# EAGLE design 19099 (EAGLE 7.6.0)
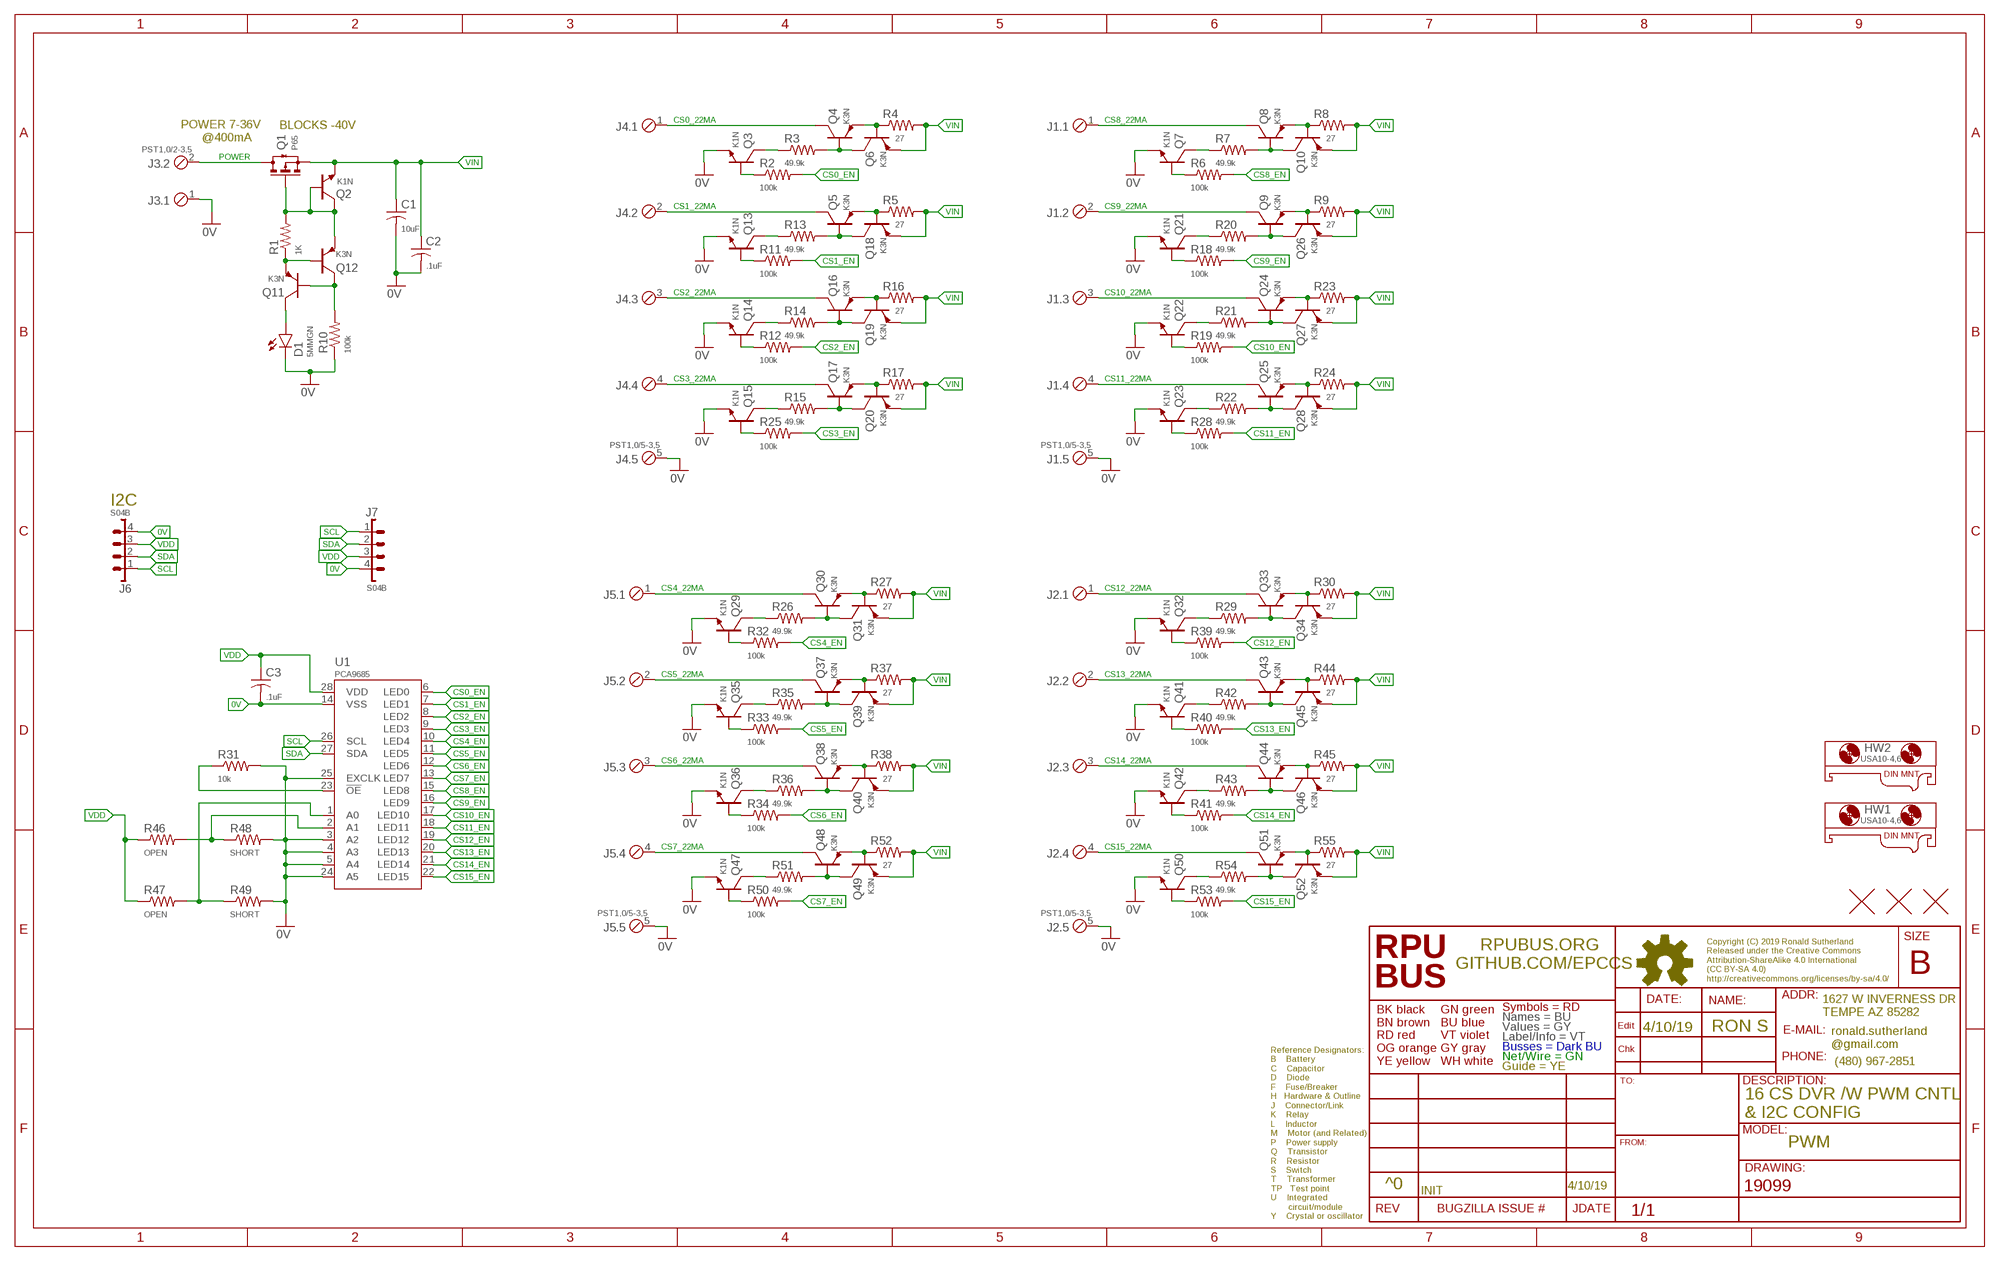
[diagram p0: schematic, sheet 1]

## Parts
C1  10uF  CC1206  [C1206(3216)]
C2  .1uF  CC0805A  [C0805(2012)]
C3  .1uF  CC0603A  [C0603(1608)]
D1  5MMGN  LED5MM  [LED5MM]
HW1  USA10-4,6  MOUNT-HOLE5.0  [USA10]
HW2  USA10-4,6  MOUNT-HOLE5.0  [USA10]
J1  PST1,0/5-3,5  MCV5  [MCV5]
J2  PST1,0/5-3,5  MCV5  [MCV5]
J3  PST1,0/2-3,5  MCV2  [MCV2]
J4  PST1,0/5-3,5  MCV5  [MCV5]
J5  PST1,0/5-3,5  MCV5  [MCV5]
J6  S04B  B04B  [B04B]
J7  S04B  B04B  [B04B]
Q1  P65  N-CHSOT23  [SOT23]
Q2  K1N  NPNSOT23  [SOT23]
Q3  K1N  NPNSOT23  [SOT23]
Q4  K3N  PNPSOT23  [SOT23]
Q5  K3N  PNPSOT23  [SOT23]
Q6  K3N  PNPSOT23  [SOT23]
Q7  K1N  NPNSOT23  [SOT23]
Q8  K3N  PNPSOT23  [SOT23]
Q9  K3N  PNPSOT23  [SOT23]
Q10  K3N  PNPSOT23  [SOT23]
Q11  K3N  PNPSOT23  [SOT23]
Q12  K3N  PNPSOT23  [SOT23]
Q13  K1N  NPNSOT23  [SOT23]
Q14  K1N  NPNSOT23  [SOT23]
Q15  K1N  NPNSOT23  [SOT23]
Q16  K3N  PNPSOT23  [SOT23]
Q17  K3N  PNPSOT23  [SOT23]
Q18  K3N  PNPSOT23  [SOT23]
Q19  K3N  PNPSOT23  [SOT23]
Q20  K3N  PNPSOT23  [SOT23]
Q21  K1N  NPNSOT23  [SOT23]
Q22  K1N  NPNSOT23  [SOT23]
Q23  K1N  NPNSOT23  [SOT23]
Q24  K3N  PNPSOT23  [SOT23]
Q25  K3N  PNPSOT23  [SOT23]
Q26  K3N  PNPSOT23  [SOT23]
Q27  K3N  PNPSOT23  [SOT23]
Q28  K3N  PNPSOT23  [SOT23]
Q29  K1N  NPNSOT23  [SOT23]
Q30  K3N  PNPSOT23  [SOT23]
Q31  K3N  PNPSOT23  [SOT23]
Q32  K1N  NPNSOT23  [SOT23]
Q33  K3N  PNPSOT23  [SOT23]
Q34  K3N  PNPSOT23  [SOT23]
Q35  K1N  NPNSOT23  [SOT23]
Q36  K1N  NPNSOT23  [SOT23]
Q37  K3N  PNPSOT23  [SOT23]
Q38  K3N  PNPSOT23  [SOT23]
Q39  K3N  PNPSOT23  [SOT23]
Q40  K3N  PNPSOT23  [SOT23]
Q41  K1N  NPNSOT23  [SOT23]
Q42  K1N  NPNSOT23  [SOT23]
Q43  K3N  PNPSOT23  [SOT23]
Q44  K3N  PNPSOT23  [SOT23]
Q45  K3N  PNPSOT23  [SOT23]
Q46  K3N  PNPSOT23  [SOT23]
Q47  K1N  NPNSOT23  [SOT23]
Q48  K3N  PNPSOT23  [SOT23]
Q49  K3N  PNPSOT23  [SOT23]
Q50  K1N  NPNSOT23  [SOT23]
Q51  K3N  PNPSOT23  [SOT23]
Q52  K3N  PNPSOT23  [SOT23]
R1  1K  R0805  [C0805(2012)]
R2  100k  R0805  [C0805(2012)]
R3  49.9k  R0805  [C0805(2012)]
R4  27  R0805  [C0805(2012)]
R5  27  R0805  [C0805(2012)]
R6  100k  R0805  [C0805(2012)]
R7  49.9k  R0805  [C0805(2012)]
R8  27  R0805  [C0805(2012)]
R9  27  R0805  [C0805(2012)]
R10  100k  R0805  [C0805(2012)]
R11  100k  R0805  [C0805(2012)]
R12  100k  R0805  [C0805(2012)]
R13  49.9k  R0805  [C0805(2012)]
R14  49.9k  R0805  [C0805(2012)]
R15  49.9k  R0805  [C0805(2012)]
R16  27  R0805  [C0805(2012)]
R17  27  R0805  [C0805(2012)]
R18  100k  R0805  [C0805(2012)]
R19  100k  R0805  [C0805(2012)]
R20  49.9k  R0805  [C0805(2012)]
R21  49.9k  R0805  [C0805(2012)]
R22  49.9k  R0805  [C0805(2012)]
R23  27  R0805  [C0805(2012)]
R24  27  R0805  [C0805(2012)]
R25  100k  R0805  [C0805(2012)]
R26  49.9k  R0805  [C0805(2012)]
R27  27  R0805  [C0805(2012)]
R28  100k  R0805  [C0805(2012)]
R29  49.9k  R0805  [C0805(2012)]
R30  27  R0805  [C0805(2012)]
R31  10k  R0805  [C0805(2012)]
R32  100k  R0805  [C0805(2012)]
R33  100k  R0805  [C0805(2012)]
R34  100k  R0805  [C0805(2012)]
R35  49.9k  R0805  [C0805(2012)]
R36  49.9k  R0805  [C0805(2012)]
R37  27  R0805  [C0805(2012)]
R38  27  R0805  [C0805(2012)]
R39  100k  R0805  [C0805(2012)]
R40  100k  R0805  [C0805(2012)]
R41  100k  R0805  [C0805(2012)]
R42  49.9k  R0805  [C0805(2012)]
R43  49.9k  R0805  [C0805(2012)]
R44  27  R0805  [C0805(2012)]
R45  27  R0805  [C0805(2012)]
R46  OPEN  R0805  [C0805(2012)]
R47  OPEN  R0805  [C0805(2012)]
R48  SHORT  R0805  [C0805(2012)]
R49  SHORT  R0805  [C0805(2012)]
R50  100k  R0805  [C0805(2012)]
R51  49.9k  R0805  [C0805(2012)]
R52  27  R0805  [C0805(2012)]
R53  100k  R0805  [C0805(2012)]
R54  49.9k  R0805  [C0805(2012)]
R55  27  R0805  [C0805(2012)]
U1  PCA9685  [28TSSOP]
U$2  FIDUCIAL1.27  [FIDUCIAL-1.27]
U$3  FIDUCIAL1.27  [FIDUCIAL-1.27]
U$4  FIDUCIAL1.27  [FIDUCIAL-1.27]

## Nets
0V: C1.2 C2.2 C3.2 D1.K J1.5 J2.5 J3.1 J4.5 J5.5 J6.4 J7.4 Q3.E Q7.E Q13.E Q14.E Q15.E Q21.E Q22.E Q23.E Q29.E Q32.E Q35.E Q36.E Q41.E Q42.E Q47.E Q50.E R10.1 R31.2 R48.2 R49.2 U1.3(A2) U1.4(A3) U1.5(A4) U1.14(VSS) U1.24(A5) U1.25(EXCLK)
A0: R47.2 R49.1 U1.1(A0)
A1: R46.2 R48.1 U1.2(A1)
CS0_22MA: J4.1 Q4.C
CS0_EN: R2.2 U1.6(LED0)
CS1_22MA: J4.2 Q5.C
CS1_EN: R11.2 U1.7(LED1)
CS2_22MA: J4.3 Q16.C
CS2_EN: R12.2 U1.8(LED2)
CS3_22MA: J4.4 Q17.C
CS3_EN: R25.2 U1.9(LED3)
CS4_22MA: J5.1 Q30.C
CS4_EN: R32.2 U1.10(LED4)
CS5_22MA: J5.2 Q37.C
CS5_EN: R33.2 U1.11(LED5)
CS6_22MA: J5.3 Q38.C
CS6_EN: R34.2 U1.12(LED6)
CS7_22MA: J5.4 Q48.C
CS7_EN: R50.2 U1.13(LED7)
CS8_22MA: J1.1 Q8.C
CS8_EN: R6.2 U1.15(LED8)
CS9_22MA: J1.2 Q9.C
CS9_EN: R18.2 U1.16(LED9)
CS10_22MA: J1.3 Q24.C
CS10_EN: R19.2 U1.17(LED10)
CS11_22MA: J1.4 Q25.C
CS11_EN: R28.2 U1.18(LED11)
CS12_22MA: J2.1 Q33.C
CS12_EN: R39.2 U1.19(LED12)
CS13_22MA: J2.2 Q43.C
CS13_EN: R40.2 U1.20(LED13)
CS14_22MA: J2.3 Q44.C
CS14_EN: R41.2 U1.21(LED14)
CS15_22MA: J2.4 Q51.C
CS15_EN: R53.2 U1.22(LED15)
N$1: Q4.E Q6.B R4.1
N$2: Q3.B R2.1
N$3: Q5.E Q18.B R5.1
N$4: Q5.B Q18.C R13.2
N$5: Q11.B Q12.C R10.2
N$6: Q1.1(G)(G) Q2.B Q2.C Q12.E R1.2
N$7: D1.A Q11.C
N$8: Q13.C R13.1
N$9: Q4.B Q6.C R3.2
N$10: Q11.E Q12.B R1.1
N$11: Q13.B R11.1
N$12: Q16.E Q19.B R16.1
N$13: Q16.B Q19.C R14.2
N$14: Q14.C R14.1
N$15: Q14.B R12.1
N$16: Q17.E Q20.B R17.1
N$17: Q17.B Q20.C R15.2
N$18: Q15.C R15.1
N$19: Q15.B R25.1
N$22: R31.1 U1.23(!OE)
N$23: Q30.E Q31.B R27.1
N$24: Q30.B Q31.C R26.2
N$25: Q29.C R26.1
N$26: Q29.B R32.1
N$27: Q37.E Q39.B R37.1
N$28: Q37.B Q39.C R35.2
N$29: Q35.C R35.1
N$30: Q35.B R33.1
N$31: Q38.E Q40.B R38.1
N$32: Q38.B Q40.C R36.2
N$33: Q36.C R36.1
N$34: Q36.B R34.1
N$35: Q48.E Q49.B R52.1
N$36: Q48.B Q49.C R51.2
N$37: Q47.C R51.1
N$38: Q47.B R50.1
N$39: Q8.E Q10.B R8.1
N$40: Q8.B Q10.C R7.2
N$41: Q7.C R7.1
N$42: Q7.B R6.1
N$43: Q9.E Q26.B R9.1
N$44: Q9.B Q26.C R20.2
N$45: Q21.C R20.1
N$46: Q21.B R18.1
N$47: Q24.E Q27.B R23.1
N$48: Q24.B Q27.C R21.2
N$49: Q22.C R21.1
N$50: Q22.B R19.1
N$51: Q25.E Q28.B R24.1
N$52: Q25.B Q28.C R22.2
N$53: Q23.C R22.1
N$54: Q23.B R28.1
N$55: Q33.E Q34.B R30.1
N$56: Q33.B Q34.C R29.2
N$57: Q32.C R29.1
N$58: Q32.B R39.1
N$59: Q43.E Q45.B R44.1
N$60: Q3.C R3.1
N$61: Q43.B Q45.C R42.2
N$62: Q41.C R42.1
N$63: Q41.B R40.1
N$64: Q44.E Q46.B R45.1
N$65: Q44.B Q46.C R43.2
N$66: Q42.C R43.1
N$67: Q42.B R41.1
N$68: Q51.E Q52.B R55.1
N$69: Q51.B Q52.C R54.2
N$70: Q50.C R54.1
N$71: Q50.B R53.1
POWER: J3.2 Q1.3(D)(D)
SCL: J6.1 J7.1 U1.26(SCL)
SDA: J6.2 J7.2 U1.27(SDA)
VDD: C3.1 J6.3 J7.3 R46.1 R47.1 U1.28(VDD)
VIN: C1.1 C2.1 Q1.2(S)(S) Q2.E Q6.E Q10.E Q18.E Q19.E Q20.E Q26.E Q27.E Q28.E Q31.E Q34.E Q39.E Q40.E Q45.E Q46.E Q49.E Q52.E R4.2 R5.2 R8.2 R9.2 R16.2 R17.2 R23.2 R24.2 R27.2 R30.2 R37.2 R38.2 R44.2 R45.2 R52.2 R55.2

## Notes on the sheet
- BLOCKS -40V
- POWER 7-36V 
        @400mA
- I2C
- 4/10/19 | RON S
- 16 CS DVR /W PWM CNTL
  & I2C CONFIG
- PWM
- ^0 | 4/10/19
- INIT

## Library data of the parts
C1-C3 = C-C:C: CAPACITOR Symbol
D1 = D-LED:LED: LED 120120WH [CREE,XHGAWT-00-0000-00000HXE1] LED WHITE 6500K 150LUM-W120120
HW1 HW2 = HW-DINMnt:MOUNT-HOLE: USA10-4.6 [PhxCont,1202713] DINRAIL ADAPTER UNIVERSAL 10MM 4.6MM
J1 J2 J4 J5 = J-HDR3.5mm:MCV5: MCV 1,5/5-G-3,5-RN [PHOENIX CONTACT,1843635] CONN HEADER SHROUDED 5POS 3.5MM MCVR 1,5/5-ST-3,5 [PHOENIX CONTACT,1863181] CONN PLUG 5POS SCREW 3.5MM PST 1,0/5-3,5 [PHOENIX CONTACT,1945122] CONN HEADER STRIP PIN 5POS 3.5MM PT 1,5/5-PVH-3,5 [PHOENIX CONTACT,1984044] CONN PLUG STRIP 4POS 3.5MM Drill Size 3/64": .0469" (1.2mm)
J3 = J-HDR3.5mm:MCV2: MCV 1,5/ 2-G-3,5-RN [PHOENIX CONTACT,1731471] CONN HEADER SHROUDED 2POS 3.5MM MCVR 1,5/ 2-ST-3,5 [PHOENIX CONTACT,1863152] CONN PLUG 2POS SCREW 3.5MM PST 1,0/2-3,5 [PHOENIX CONTACT,1945096] CONN HEADER STRIP PIN 2POS 3.5MM PT1,5/2-PVH-3,5 [PHOENIX CONTACT,1984015] CONN PLUG STRIP 2POS 3.5MM
J6 J7 = J-HDR2mm:B04B: B04B [JST@B04B-PASK] CONN HEADER VERT THRU 4POS S04B [JST@S04B-PASK] CONN HEADER SIDE THRU 4POS
Q1 = Q-PCH:N-CH?*: ENHANCEMENT MODE MOSFET SOT23 is BSS138 pinout
Q2 Q3 Q7 Q13-Q15 Q21-Q23 Q29 Q32 Q35 Q36 Q41 Q42 Q47 Q50 = Q-NPN:NPN: BJT NPN General Purpose Amplifier
Q4-Q6 Q8-Q12 Q16-Q20 Q24-Q28 Q30 Q31 Q33 Q34 Q37-Q40 Q43-Q46 Q48 Q49 Q51 Q52 = Q-PNP:PNP: BJT NPN General Purpose Amplifier
R1-R55 = R-C:R: Resiistor American-style symbol
U1 = U-Linear:PCA9685: PCA9685 16-channel, I2C-bus commanded 12-bit PWM controller
U$2-U$4 = H-Fiducial:FIDUCIAL: Fiducial Alignment Points Various fiducial points for machine vision alignment.

## Net classes
0 default: width 0.178 mm, drill 0.33 mm

## Board
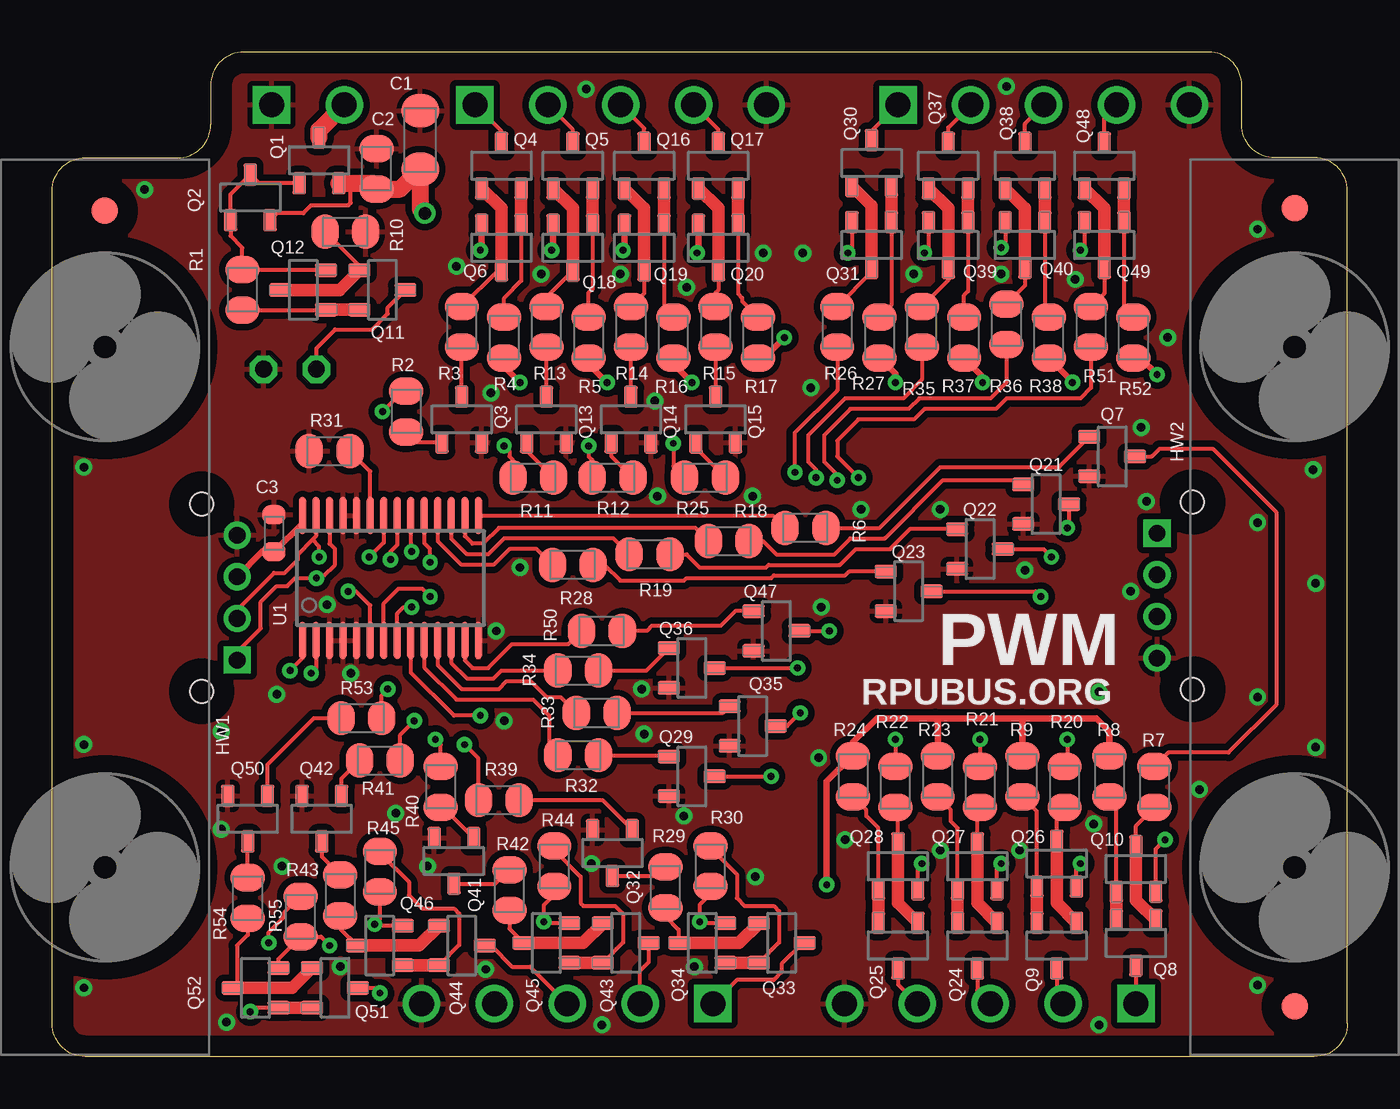
[diagram p1: board, top side]
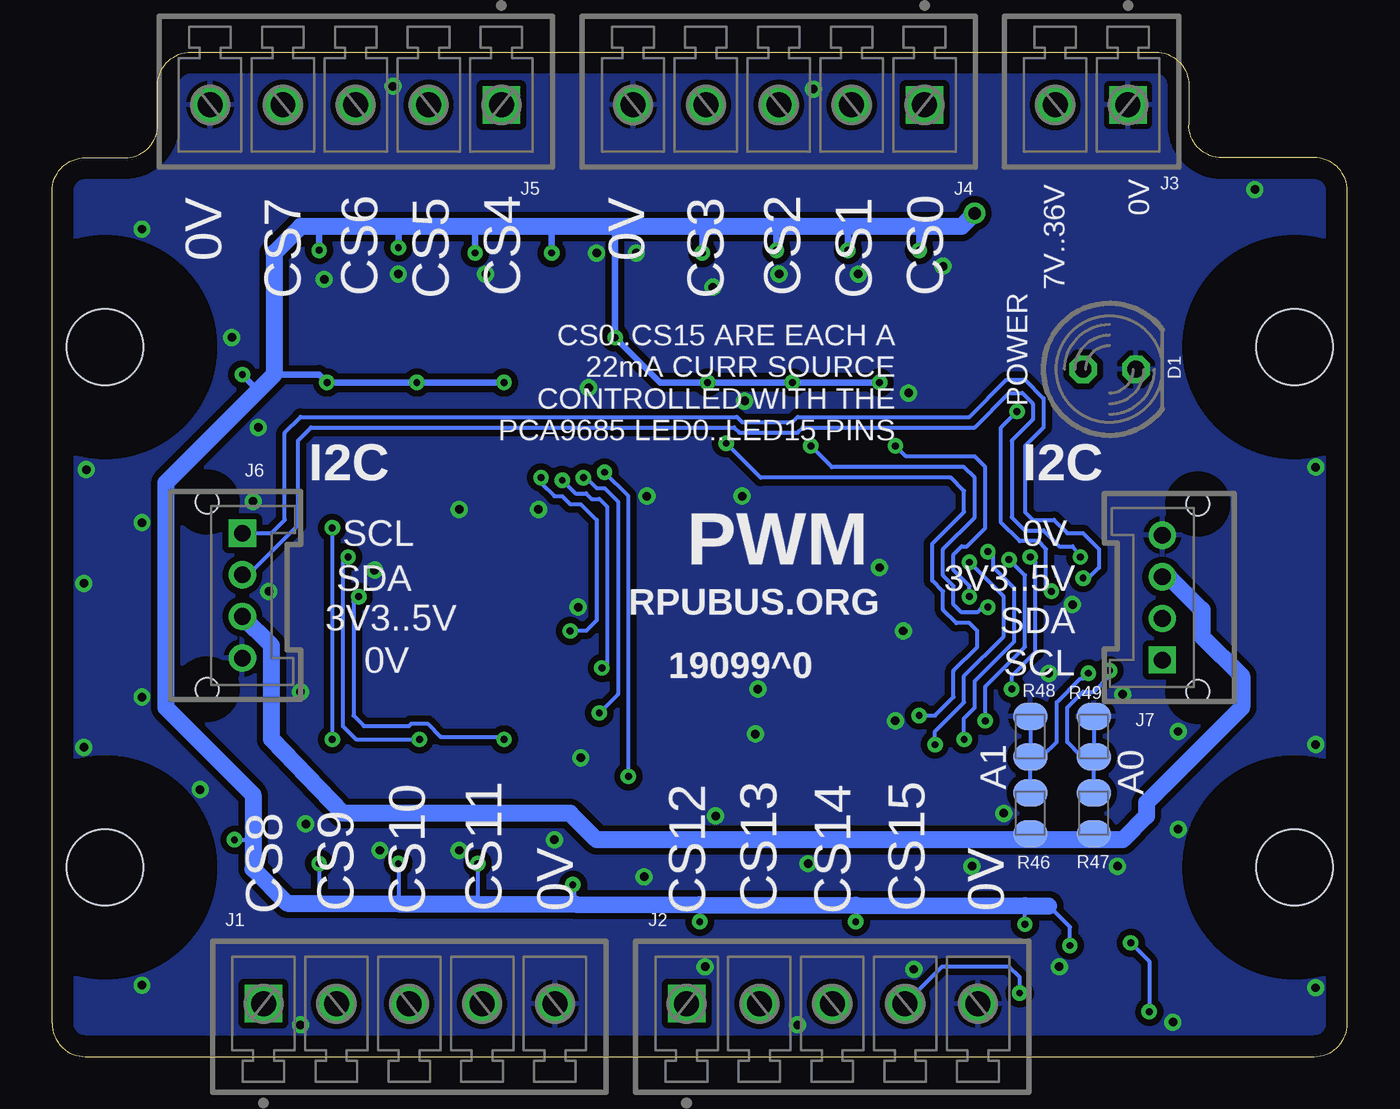
[diagram p2: board, bottom side, seen from below]

Size 62.23 x 48.26 mm. Coordinates in mm from the lower left corner, seen from the top.
Outline: 62.23,1.59 62.23,41.59 arc90 60.64,43.18 58.74,43.18 arc-90 57.15,44.77 57.15,46.67 arc90 55.56,48.26 9.21,48.26 arc90 7.62,46.67 7.62,44.77 arc-90 6.03,43.18 1.59,43.18 arc90 0,41.59 0,1.59 arc90 1.59,0 60.64,0 arc90 62.23,1.59
Copper layers (1*16): Top 0.034290625mm / dielectric 60mil / Bottom 0.034290625mm
Design rules "default *": minimum track width 7mil, minimum drill 13mil, track to track 12mil, track to pad 10mil, pad to pad 8mil, via to via 12mil, smd to smd 8mil, copper to edge 40mil, drill to drill 16mil, minimum pad ring 10mil, minimum via ring 8mil, stop-mask expansion 4mil, vias tented up to drill 17mil, thermal gap 10mil

### Footprints (pad centres in the part's own frame; a part is rotated, then mirrored left to right if it is on the bottom)
C1206(3216) = smd 1.6 x 1.8: 1 -1.4,0; 2 1.4,0
C0805(2012) = smd 1.321 x 1.651: 1 -0.977,0; 2 0.977,0
C0603(1608) = smd 0.898 x 1.1: 1 -0.889,0; 2 0.889,0
LED5MM = drill 0.813 octagon: A -1.27,0; K 1.27,0
USA10 = hole 3.658: -12.5,0; 12.5,0
MCV5 = drill 1.2 square: 1 0,0 | drill 1.2: 2 3.5,0; 3 7,0; 4 10.5,0; 5 14,0
MCV2 = drill 1.2 square: 1 0,0 | drill 1.2: 2 3.5,0
B04B = drill 0.8 square: 1 0,0 | drill 0.8: 2 2,0; 3 4,0; 4 6,0 | hole 1.1: 7.5,-1.7; -1.5,-1.7
SOT23 = smd 0.65 x 1.06: 1(G) -0.95,-1.1; 2(S) 0.95,-1.1; 3(D) 0,1.1
SOT23' = smd 0.65 x 1.06: B -0.95,-1.1; C 0,1.1; E 0.95,-1.1
28TSSOP = smd 0.33 x 1.8: 1 -4.225,-3; 2 -3.575,-3; 3 -2.925,-3; 4 -2.275,-3; 5 -1.625,-3; 6 -0.975,-3; 7 -0.325,-3; 8 0.325,-3; 9 0.975,-3; 10 1.625,-3; 11 2.275,-3; 12 2.925,-3; 13 3.575,-3; 14 4.225,-3; 15 4.225,3; 16 3.575,3; 17 2.925,3; 18 2.275,3; 19 1.625,3; 20 0.975,3; 21 0.325,3; 22 -0.325,3; 23 -0.975,3; 24 -1.625,3; 25 -2.275,3; 26 -2.925,3; 27 -3.575,3; 28 -4.225,3
FIDUCIAL-1.27 = smd 1.27 x 1.27: 1 0,0

### Placement (x,y rotation side)
C1  17.69,44.03 90 top
C2  15.59,42.65 90 top
C3  10.67,25.15 90 top
D1  11.43,33.02 0 bottom
HW1  2.54,21.59 90 top
HW2  59.69,21.59 90 top
J1  52.07,2.54 0 bottom
J2  31.75,2.54 0 bottom
J3  10.54,45.72 180 bottom
J4  20.32,45.72 180 bottom
J5  40.64,45.72 180 bottom
J6  53.09,25.15 270 bottom
J7  8.89,19.05 90 bottom
Q1  12.83,43.05 0 top
Q2  K1N  [SOT23']  9.53,41.27 0 top
Q3  K1N  [SOT23']  19.68,30.61 0 top
Q4  K3N  [SOT23']  21.59,42.8 0 top
Q5  K3N  [SOT23']  25.02,42.8 0 top
Q6  K3N  [SOT23']  21.59,38.86 180 top
Q7  K1N  [SOT23']  50.93,28.83 270 top
Q8  K3N  [SOT23']  52.07,5.46 180 top
Q9  K3N  [SOT23']  48.26,5.33 180 top
Q10  K3N  [SOT23']  52.07,9.02 0 top
Q11  K3N  [SOT23']  15.88,36.83 270 top
Q12  K3N  [SOT23']  12.07,36.83 90 top
Q13  K1N  [SOT23']  23.75,30.61 0 top
Q14  K1N  [SOT23']  27.81,30.61 0 top
Q15  K1N  [SOT23']  31.88,30.61 0 top
Q16  K3N  [SOT23']  28.45,42.8 0 top
Q17  K3N  [SOT23']  32,42.8 0 top
Q18  K3N  [SOT23']  25.02,38.86 180 top
Q19  K3N  [SOT23']  28.45,38.86 180 top
Q20  K3N  [SOT23']  32,38.86 180 top
Q21  K1N  [SOT23']  47.75,26.54 270 top
Q22  K1N  [SOT23']  44.58,24.38 270 top
Q23  K1N  [SOT23']  41.15,22.35 270 top
Q24  K3N  [SOT23']  44.45,5.33 180 top
Q25  K3N  [SOT23']  40.64,5.33 180 top
Q26  K3N  [SOT23']  48.26,9.27 0 top
Q27  K3N  [SOT23']  44.45,9.14 0 top
Q28  K3N  [SOT23']  40.64,9.14 0 top
Q29  K1N  [SOT23']  30.73,13.46 270 top
Q30  K3N  [SOT23']  39.37,42.93 0 top
Q31  K3N  [SOT23']  39.37,38.99 180 top
Q32  K1N  [SOT23']  26.92,9.78 180 top
Q33  K3N  [SOT23']  35.05,5.46 270 top
Q34  K3N  [SOT23']  31.24,5.46 90 top
Q35  K1N  [SOT23']  33.65,15.88 270 top
Q36  K1N  [SOT23']  30.73,18.67 270 top
Q37  K3N  [SOT23']  43.05,42.8 0 top
Q38  K3N  [SOT23']  46.74,42.8 0 top
Q39  K3N  [SOT23']  43.05,38.99 180 top
Q40  K3N  [SOT23']  46.74,38.99 180 top
Q41  K1N  [SOT23']  19.3,9.4 180 top
Q42  K1N  [SOT23']  12.95,11.43 180 top
Q43  K3N  [SOT23']  27.56,5.46 270 top
Q44  K3N  [SOT23']  19.68,5.33 270 top
Q45  K3N  [SOT23']  23.75,5.46 90 top
Q46  K3N  [SOT23']  15.75,5.33 90 top
Q47  K1N  [SOT23']  34.8,20.45 270 top
Q48  K3N  [SOT23']  50.55,42.8 0 top
Q49  K3N  [SOT23']  50.55,38.99 180 top
Q50  K1N  [SOT23']  9.4,11.43 180 top
Q51  K3N  [SOT23']  13.59,3.3 270 top
Q52  K3N  [SOT23']  9.78,3.3 90 top
R1  9.14,36.83 90 top
R2  17.02,30.99 90 top
R3  19.68,35.05 90 top
R4  21.72,34.54 270 top
R5  25.78,34.54 270 top
R6  36.2,25.4 180 top
R7  52.96,12.95 270 top
R8  50.8,13.46 90 top
R9  46.61,13.46 90 top
R10  14.1,39.62 180 top
R11  23.11,27.81 180 top
R12  26.92,27.81 180 top
R13  23.75,35.05 90 top
R14  27.81,35.05 90 top
R15  31.88,35.05 90 top
R16  29.84,34.54 270 top
R17  33.91,34.54 270 top
R18  32.51,24.77 180 top
R19  28.7,24.13 180 top
R20  48.64,12.95 270 top
R21  44.58,12.95 270 top
R22  40.51,12.95 270 top
R23  42.54,13.46 90 top
R24  38.48,13.46 90 top
R25  31.37,27.81 180 top
R26  37.72,35.05 90 top
R27  39.75,34.54 270 top
R28  25.02,23.62 180 top
R29  29.46,8.13 270 top
R30  31.62,9.14 270 top
R31  13.34,29.08 180 top
R32  25.27,14.48 180 top
R33  26.16,16.51 180 top
R34  25.27,18.54 180 top
R35  41.78,35.05 90 top
R36  45.85,35.18 90 top
R37  43.81,34.54 270 top
R38  47.88,34.54 270 top
R39  21.46,12.32 180 top
R40  18.67,12.95 90 top
R41  15.75,14.22 0 top
R42  21.97,8 270 top
R43  13.84,7.75 270 top
R44  24.13,9.14 270 top
R45  15.75,8.89 270 top
R46  15.24,11.68 90 bottom
R47  12.19,11.68 90 bottom
R48  15.24,15.37 90 bottom
R49  12.19,15.37 90 bottom
R50  26.42,20.45 180 top
R51  49.91,35.05 90 top
R52  51.94,34.54 270 top
R53  14.86,16.26 0 top
R54  9.4,7.62 270 top
R55  11.94,6.73 270 top
U1  16.26,22.99 0 top
U$2  59.69,40.77 0 top
U$3  2.54,40.64 0 top
U$4  59.69,2.41 0 top

### Tracks (layer width: path | path; a pad name or v marks a point on that pad's centre or on a via)
0V  (via drill 0.41)
  other vias: 4.45,41.66 51.82,22.35 52.58,26.67 46.74,23.37 50.29,17.53 49.15,37.34 45.59,37.59 41.4,37.59 36.07,38.61 36.96,21.59 33.65,26.92 21.08,31.88 19.43,37.97 30.48,36.96 27.3,37.59 23.5,37.59 60.58,28.19 57.91,25.65 57.91,17.27 60.71,14.86 60.71,22.73 55.12,12.83 57.91,3.43 50.29,1.52 26.42,1.52 45.85,46.61 25.65,46.48 57.91,39.75 53.59,34.54 52.32,30.23 34.16,38.61 36.45,32.13 28.96,31.5 22.48,23.5 29.08,26.92 13.21,21.72 21.34,20.45 21.72,16.13 14.35,18.41 10.79,17.4 16.51,11.68 11.05,9.14 1.52,28.32 1.52,14.99 8.13,15.62 8.13,10.92 1.52,3.3 8.38,1.65 13.84,4.32 20.83,4.19 18.03,9.14 25.91,9.27 30.86,4.32 33.78,8.64 30.35,11.56 28.45,15.49 28.32,17.65 36.83,14.35 42.67,26.29 38.86,26.29 42.67,9.91 46.48,9.91 50.04,11.18 38.1,10.41
  pour Bottom (isolate 0.305): 0,48.26 62.23,48.26 62.23,0 0,0
  pour Top (isolate 0.305, rank 6): 0,48.26 62.23,48.26 62.23,0 0,0
A0  (via drill 0.33)
  Top 0.203: 11.68,18.8 v11.43,18.54 12.03,19.14 U1.1
  Bottom 0.203: R47.2 R49.1 12.28,14.48 12.83,14.48 13.46,15.11 13.46,16.76 12.7,17.53 12.19,17.53 11.43,18.29 v11.43,18.54
A1  (via drill 0.33)
  Top 0.203: U1.2 12.68,18.65 v12.45,18.41
  Bottom 0.203: R46.2 R48.1 14.69,14.39 13.97,15.11 13.97,17.02 12.83,18.16 12.7,18.16 v12.45,18.41
CS0_22MA
  Top 0.203: Q4.C 21.59,44.45 J4.1
CS0_EN  (via drill 0.33)
  Top 0.203: U1.6 15.28,21.68 14.61,22.35 v14.22,22.35 | R2.2 16.85,31.96 v15.88,30.99
  Bottom 0.203: v14.22,22.35 14.48,22.61 14.48,24.38 14.86,24.77 15.75,24.77 16.64,25.65 16.64,30.23 v15.88,30.99
CS1_22MA
  Top 0.203: Q5.C 25.02,44.52 J4.2
CS1_EN  (via drill 0.33)
  Top 0.203: U1.7 15.93,21.77 16.64,22.48 17.78,22.48 v18.16,22.1 | v21.72,29.34 21.97,29.08 21.97,28.83 22.14,28.66 R11.2
  Bottom 0.203: v18.16,22.1 18.16,22.61 18.92,23.37 18.92,24.13 18.54,24.51 18.29,24.51 17.4,25.4 17.4,28.32 17.91,28.83 21.21,28.83 v21.72,29.34
CS2_22MA
  Top 0.203: Q16.C 28.45,44.59 J4.3
CS2_EN  (via drill 0.33)
  Top 0.203: U1.8 16.58,21.28 16.89,21.59 v17.27,21.59 | v25.78,29.34 25.78,28.83 25.95,28.66 R12.2
  Bottom 0.203: v17.27,21.59 17.53,21.59 17.78,21.34 18.54,21.34 18.92,21.72 18.92,22.61 19.43,23.11 19.43,24.38 17.91,25.91 17.91,27.81 18.41,28.32 24.77,28.32 v25.78,29.34
CS3_22MA
  Top 0.203: Q17.C 32,44.54 J4.4
CS3_EN  (via drill 0.33)
  Top 0.203: v29.84,29.46 29.84,28.36 R25.2 | U1.9 17.23,18.46 19.3,16.38 v20.57,16.38
  Bottom 0.203: v20.57,16.38 19.81,16.38 18.92,17.27 18.92,18.54 17.78,19.68 17.78,20.45 18.16,20.83 18.8,20.83 19.43,21.46 19.43,22.35 19.94,22.86 19.94,24.64 18.41,26.16 18.41,27.18 19.05,27.81 28.19,27.81 v29.84,29.46
CS4_22MA
  Top 0.203: Q30.C 39.37,44.45 J5.1
CS4_EN
  Top 0.203: U1.10 17.88,18.7 19.43,17.14 23.11,17.14 23.88,16.38 23.88,14.9 R32.2
CS5_22MA
  Top 0.203: Q37.C 43.05,44.63 J5.2
CS5_EN
  Top 0.203: U1.11 18.53,18.81 19.68,17.65 21.46,17.65 21.84,18.03 22.99,18.03 23.75,17.27 24.42,17.27 R33.2
CS6_22MA
  Top 0.203: Q38.C 46.74,44.82 J5.3
CS6_EN
  Top 0.203: U1.12 19.18,18.92 19.94,18.16 21.21,18.16 21.59,18.54 R34.2
CS7_22MA
  Top 0.203: Q48.C 50.55,45.13 J5.4
CS7_EN
  Top 0.203: U1.13 19.83,19.03 20.19,18.67 20.96,18.67 22.1,19.81 24.8,19.81 R50.2
CS8_22MA
  Top 0.203: Q8.C J1.1
CS8_EN
  Top 0.203: U1.15 34.63,25.99 R6.2
CS9_22MA
  Top 0.203: Q9.C 48.26,2.85 J1.2
CS9_EN
  Top 0.203: U1.16 19.83,25 20.19,24.64 20.7,24.64 21.46,25.4 30.9,25.4 R18.2
CS10_22MA
  Top 0.203: Q24.C 44.45,3.16 J1.3
CS10_EN
  Top 0.203: U1.17 19.18,24.89 19.94,24.13 20.96,24.13 21.72,24.89 26.96,24.89 R19.2
CS11_22MA
  Top 0.203: Q25.C 40.64,3.47 J1.4
CS11_EN
  Top 0.203: U1.18 18.53,24.78 19.68,23.62 21.21,23.62 21.97,24.38 23.28,24.38 R28.2
CS12_22MA
  Top 0.203: Q33.C 36.07,5.46 35.05,4.45 35.05,4.06 34.67,3.68 32.89,3.68 J2.1
CS12_EN  (via drill 0.33)
  Top 0.203: R39.2 20.49,14.31 v19.81,14.99 | v18.16,23.75 18.16,24.38 17.88,24.66 U1.19
  Bottom 0.203: v19.81,14.99 19.81,15.62 18.41,17.02 18.41,18.29 16.51,20.19 16.51,22.1 v18.16,23.75
CS13_22MA
  Top 0.203: Q43.C 28.66,4.53 28.25,4.12 J2.2
CS13_EN  (via drill 0.33)
  Top 0.203: R40.2 18.67,14.99 v18.41,15.24 | U1.20 17.23,24.3 v17.27,24.26
  Bottom 0.203: v18.41,15.24 18.41,16.26 17.91,16.76 17.91,18.03 16,19.94 16,22.48 17.02,23.5 17.02,24 v17.27,24.26
CS14_22MA
  Top 0.203: Q44.C 21.08,5.33 22.1,4.32 22.97,4.32 J2.3
CS14_EN  (via drill 0.33)
  Top 0.203: R41.2 16.73,15.46 v17.4,16.13 | v16.26,23.88 16.26,24.26 16.58,24.58 U1.21
  Bottom 0.203: v17.4,16.13 17.4,17.78 15.49,19.68 15.49,23.11 v16.26,23.88
CS15_22MA  (via drill 0.33)
  Top 0.203: Q51.C 15.49,3.3 v15.75,3.05
  Bottom 0.203: v15.75,3.05 15.75,3.81 16.26,4.32 19.47,4.32 J2.4
CS15_EN  (via drill 0.33)
  Top 0.203: R53.2 15.84,17.36 v16.13,17.65 | v15.24,24 15.93,24.69 U1.22
  Bottom 0.203: v16.13,17.65 16.13,18.29 14.99,19.43 14.99,23.75 v15.24,24
N$1
  Top 0.203: Q6.B 22.54,37.27 21.72,36.45 R4.1
  Top 0.61: Q4.E Q6.B
N$2
  Top 0.203: Q3.B 17.52,29.51 R2.1
N$3
  Top 0.203: Q18.B 25.97,36.89 25.78,36.7 R5.1
  Top 0.61: Q5.E Q18.B
N$4
  Top 0.203: R13.2 23.75,36.49 Q18.C
  Top 0.61: Q18.C 25.02,40.75 Q5.B
N$5
  Top 0.203: Q11.B 14.78,37.97 R10.2
  Top 0.61: Q12.C 13.83,36.83 Q11.B
N$6
  Top 0.203: Q12.E 13.14,37.81 R1.2 9.14,38.86 8.58,39.43 Q2.B 8.58,41.42 Q2.C 9.95,41.95 Q1.1(G)
N$7
  Top 0.203: D1.A 12.7,34.04 13.59,34.92 15.37,34.92 16.13,35.69 16.13,35.98 Q11.C
N$8
  Top 0.203: Q13.C R13.1
N$9
  Top 0.203: Q6.C 21.42,37.76 R3.2
  Top 0.61: Q6.C 21.59,40.75 Q4.B
N$10
  Top 0.203: R1.1 13.14,35.85 Q12.B
  Top 0.61: Q11.E Q12.B
N$11
  Top 0.203: Q13.B 22.8,29.11 R11.1
N$12
  Top 0.203: Q19.B 29.4,35.97 R16.1
  Top 0.61: Q16.E Q19.B
N$13
  Top 0.203: Q19.C 28.45,36.66 R14.2
  Top 0.61: Q19.C 28.45,40.75 Q16.B
N$14
  Top 0.203: Q14.C R14.1
N$15
  Top 0.203: Q14.B 26.86,28.85 R12.1
N$16
  Top 0.203: Q20.B 32.95,36.64 33.15,36.45 33.15,36.28 R17.1
  Top 0.61: Q17.E Q20.B
N$17
  Top 0.203: R15.2 31.88,36.7 32,36.83 Q20.C
  Top 0.61: Q20.C 32,40.75 Q17.B
N$18
  Top 0.203: R15.1 Q15.C
N$19
  Top 0.203: Q15.B 30.93,29.23 R25.1
N$22
  Top 0.203: U1.23 15.28,28.11 R31.1
N$23
  Top 0.203: Q31.B 40.32,36.09 R27.1
  Top 0.61: Q30.E Q31.B
N$24
  Top 0.203: Q31.C 39.37,37.68 R26.2
  Top 0.61: Q31.C 39.37,40.88 Q30.B
N$25  (via drill 0.33)
  Top 0.203: Q29.C v34.54,13.46 | v35.69,28.07 35.69,29.97 37.72,32 R26.1
  Bottom 0.203: v34.54,13.46 34.54,26.92 v35.69,28.07
N$26
  Top 0.203: R32.1 29.57,14.48 Q29.B
N$27
  Top 0.203: Q39.B 44,36.76 43.81,36.58 R37.1
  Top 0.61: Q37.E Q39.B
N$28
  Top 0.203: Q39.C 43.05,37.3 R35.2
  Top 0.61: Q39.C 43.05,40.75 Q37.B
N$29  (via drill 0.33)
  Top 0.203: R35.1 41.78,32.51 40.89,31.62 38.1,31.62 36.32,29.84 36.32,28.57 36.7,28.19 v36.7,27.81 | Q35.C 35.31,15.88 v35.94,16.51
  Bottom 0.203: v36.7,27.81 36.58,27.81 36.07,27.3 35.69,27.3 35.05,26.67 35.05,17.4 v35.94,16.51
N$30
  Top 0.203: R33.1 32.24,16.51 Q35.B
N$31
  Top 0.203: Q40.B 47.69,35.71 R38.1
  Top 0.61: Q38.E Q40.B
N$32
  Top 0.203: Q40.C 46.74,37.05 R36.2
  Top 0.61: Q40.C 46.74,40.75 Q38.B
N$33  (via drill 0.33)
  Top 0.203: Q36.C v35.81,18.67 | R36.1 45.85,32.38 45.08,31.62 41.66,31.62 41.15,31.11 38.35,31.11 37.08,29.84 37.08,28.57 37.72,27.94 v37.72,27.69
  Bottom 0.203: v37.72,27.69 37.08,27.05 36.58,27.05 36.32,26.8 35.94,26.8 35.56,26.42 35.56,18.92 v35.81,18.67
N$34
  Top 0.203: R34.1 28.56,18.54 Q36.B
N$35
  Top 0.203: Q49.B 51.5,35.97 R52.1
  Top 0.61: Q48.E Q49.B
N$36
  Top 0.203: Q49.C 50.55,36.66 R51.2
  Top 0.61: Q49.C 50.55,40.75 Q48.B
N$37  (via drill 0.33)
  Top 0.203: Q47.C v37.34,20.45 | R51.1 49.91,32.13 49.4,31.62 45.85,31.62 45.34,31.11 41.91,31.11 41.4,30.61 38.73,30.61 37.72,29.59 37.72,28.83 v38.73,27.81
  Bottom 0.203: v38.73,27.81 38.73,27.56 38.1,26.92 37.72,26.92 37.34,26.54 36.83,26.54 36.07,25.78 36.07,20.95 36.58,20.45 v37.34,20.45
N$38
  Top 0.203: R50.1 28.57,20.45 28.83,20.7 32.13,20.7 32.83,21.4 Q47.B
N$39
  Top 0.203: Q10.B 51.12,12.16 R8.1
  Top 0.61: Q8.E Q10.B
N$40
  Top 0.203: Q10.C 52.07,11.09 R7.2
  Top 0.61: Q10.C 52.07,7.51 Q8.B
N$41
  Top 0.203: Q7.C 52.83,28.83 53.21,29.21 55.75,29.21 58.8,26.16 58.8,16.89 56.51,14.61 53.63,14.61 R7.1
N$42
  Top 0.203: R6.1 39.75,25.4 42.67,28.32 48.37,28.32 Q7.B
N$43
  Top 0.203: Q26.B 47.31,11.78 R9.1
  Top 0.61: Q9.E Q26.B
N$44
  Top 0.203: Q26.C 48.26,11.6 R20.2
  Top 0.61: Q26.C 48.26,7.38 Q9.B
N$45  (via drill 0.33)
  Top 0.203: Q21.C 48.85,25.48 v48.77,25.4 | v48.77,15.24 48.77,14.06 R20.1
  Bottom 0.203: v48.77,25.4 v48.77,15.24
N$46
  Top 0.203: R18.1 34.16,24.77 34.8,24.13 37.59,24.13 38.35,24.89 40,24.89 42.8,27.69 46.46,27.69 Q21.B
N$47
  Top 0.203: Q27.B 43.5,10.98 43.18,11.3 43.18,11.85 R23.1
  Top 0.61: Q24.E Q27.B
N$48
  Top 0.203: Q27.C 44.45,11.85 R21.2
  Top 0.61: Q27.C 44.45,7.38 Q24.B
N$49  (via drill 0.33)
  Top 0.203: Q22.C 47.62,24.38 v48.01,24 | v44.58,15.24 R21.1
  Bottom 0.203: v48.01,24 48.26,23.75 48.26,15.88 47.62,15.24 v44.58,15.24
N$50
  Top 0.203: R19.1 30.48,24.13 31.11,23.5 34.29,23.5 34.42,23.62 37.85,23.62 38.61,24.38 40.26,24.38 41.21,25.33 Q22.B
N$51
  Top 0.203: Q28.B 39.69,10.98 39.12,11.56 39.12,11.85 R24.1
  Top 0.61: Q25.E Q28.B
N$52
  Top 0.203: Q28.C 40.64,11.85 R22.2
  Top 0.61: Q28.C 40.64,7.38 Q25.B
N$53  (via drill 0.33)
  Top 0.203: Q23.C 47.24,22.35 v47.5,22.1 | v40.51,15.24 R22.1
  Bottom 0.203: v47.5,22.1 47.75,21.84 47.75,16.38 47.24,15.88 45.08,15.88 44.96,16 44.2,16 43.56,15.37 40.64,15.37 v40.51,15.24
N$54
  Top 0.203: R28.1 26.54,23.62 27.3,22.86 30.35,22.86 30.48,22.99 34.54,22.99 34.67,23.11 38.1,23.11 38.29,23.3 Q23.B
N$55
  Top 0.203: R30.1 31.62,10.03 32.89,8.76 32.89,7.62 33.27,7.24 34.67,7.24 34.92,6.99 34.92,5.48 Q33.E
  Top 0.61: Q33.E Q34.B
N$56
  Top 0.203: R29.2 29.46,6.73 30.1,6.1 30.1,5.5 Q34.C
  Top 0.61: Q34.C 33,5.46 Q33.B
N$57
  Top 0.203: Q32.C 29.04,8.68 R29.1
N$58
  Top 0.203: R39.1 26.43,12.32 Q32.B
N$59
  Top 0.203: R44.1 24.13,9.91 25.4,8.64 25.4,7.37 25.53,7.24 27.05,7.24 27.43,6.86 27.43,5.48 Q43.E
  Top 0.61: Q43.E Q45.B
N$60
  Top 0.203: Q3.C R3.1
N$61
  Top 0.203: R42.2 21.97,6.14 Q45.C
  Top 0.61: Q45.C 25.51,5.46 Q43.B
N$62
  Top 0.203: Q41.C 21.29,8.3 R42.1
N$63
  Top 0.203: R40.1 18.78,11.98 Q41.B
N$64
  Top 0.203: R45.1 15.75,9.78 17.14,8.38 17.14,7.75 17.78,7.11 19.3,7.11 19.56,6.86 19.56,5.36 Q44.E
  Top 0.61: Q46.B Q44.E
N$65
  Top 0.203: R43.2 13.84,6.14 Q46.C
  Top 0.61: Q46.C 17.64,5.33 Q44.B
N$66
  Top 0.203: Q42.C 12.95,9.61 R43.1
N$67
  Top 0.203: Q42.B 13.9,13.36 R41.1
N$68  (via drill 0.33)
  Top 0.203: 9.65,2.29 v9.53,2.16 9.72,2.35 Q52.B | v10.41,5.46 10.41,5.97 11.18,6.73 11.18,6.95 R55.1
  Top 0.61: Q52.B Q51.E
  Bottom 0.203: v10.41,5.46 9.53,4.57 v9.53,2.16
N$69
  Top 0.203: R54.2 9.4,5.84 8.89,5.33 8.89,3.51 Q52.C
  Top 0.61: Q52.C 11.54,3.3 Q51.B
N$70
  Top 0.203: R54.1 Q50.C
N$71
  Top 0.203: Q50.B 10.35,14.03 12.57,16.26 R53.1
N$72
  Bottom 0.203: 12.19,15.88 12.19,14.73
N$73
  Bottom 0.203: 15.24,15.88 15.24,14.86
POWER
  Top 0.813: Q1.3(D) 12.83,44.51 J3.2
SCL  (via drill 0.33)
  Top 0.203: U1.26 13.33,24.64 13.59,24.38 13.59,23.62 13.08,23.11 12.83,23.11 v12.7,22.99 11.68,22.99 11.3,22.61 10.79,22.61 10.03,21.84 10.03,20.57 8.89,19.43 J7.1
  Bottom 0.203: v12.7,22.99 12.45,22.99 11.94,23.5 11.94,24.38 12.7,25.15 13.46,25.15 14.1,25.78 15.11,25.78 15.49,26.16 15.49,29.34 14.61,30.23 14.61,31.62 15.49,32.51 16.38,32.51 18.16,30.73 26.42,30.73 26.67,30.48 29.08,30.48 29.34,30.73 50.29,30.73 51.05,29.97 51.05,25.78 51.69,25.15 J6.1
SDA  (via drill 0.33)
  Top 0.203: J7.2 8.89,21.46 10.67,23.24 11.18,23.24 11.81,23.88 11.81,24.13 12.51,24.83 | 12.51,24.83 12.68,25 U1.27 | v12.83,24 12.83,24.51 12.51,24.83
  Bottom 0.203: J6.2 52.8,23.15 50.42,25.53 50.42,29.59 49.78,30.23 29.46,30.23 29.21,29.97 26.42,29.97 26.16,30.23 17.91,30.23 16.26,31.88 15.62,31.88 15.11,31.37 15.11,30.61 16.13,29.59 16.13,25.91 15.49,25.27 14.61,25.27 13.84,24.51 13.21,24.51 v12.83,24
VDD
  Top 0.305: U1.28 12.03,25.62 C3.1 10.1,24.26 J7.3
  Bottom 0.203: R47.1 12.19,10.41 | R46.1 15.24,10.41
  Bottom 0.813: J7.3 8.57,23.05 6.99,21.46 6.99,20.19 5.08,18.29 5.08,16.76 9.65,12.19 9.65,11.56 10.79,10.41 12.19,10.41 15.24,10.41 36.07,10.41 37.34,11.68 48.26,11.68 51.69,15.24 51.69,19.75 J6.3
VIN  (via drill 0.33, 0.61)
  Top 0.203: 14.35,41.95 14.35,41.02 14.22,40.89 12.45,40.89 12.07,40.51 10.81,40.51 Q2.E | R45.2 15.75,6.6 v15.49,6.35 15.56,6.28 Q46.E | R44.2 24.13,7.78 23.62,7.27 v23.62,6.48 23.69,6.41 Q45.E | R30.2 31.62,7.81 31.11,7.3 v31.11,6.48 31.18,6.41 Q34.E | Q28.E 41.59,9.08 v41.78,9.27 | Q27.E 45.4,9.08 v45.59,9.27 | Q26.E 49.21,9.08 v49.4,9.27 | Q10.E 53.02,9.97 v53.47,10.41 | Q49.E 49.6,38.93 v49.4,38.73 | Q40.E 45.79,39.05 v45.59,38.86 | Q39.E 42.1,38.8 v41.91,38.61 | Q31.E 38.42,38.8 v38.23,38.61 | v13.34,5.33 12.92,5.75 R55.2 10.88,4.7 Q52.E
  Top 0.305: v37.21,8.26 37.21,13.21 38.44,14.44 R24.2 38.48,15.11 39.62,16.26 42.42,16.26 | 42.42,16.26 46.61,16.26 | 46.61,16.26 50.16,16.26 50.8,15.62 R8.2 | v53.09,32.77 52.28,33.57 R52.2 | R17.2 34.2,33.57 v35.18,34.54 | R4.2 21.72,33.15 v22.48,32.38 | R5.2 25.78,33.27 v26.67,32.38 | R16.2 29.84,33.27 v30.73,32.38 | Q20.E 31.05,38.67 v30.99,38.61 | Q19.E 27.5,38.8 v27.43,38.73 | Q18.E 24.07,38.8 v24,38.73 | Q6.E 20.64,38.8 v20.57,38.73 | R9.2 46.61,16.26 | R23.2 42.54,16.13 42.42,16.26 | R27.2 40.51,32.8 v40.51,32.38 | R37.2 44.7,32.68 v44.7,32.38 | R38.2 49.02,32.42 v49.02,32.38
  Top 0.813: Q1.2(S) 14.35,41.95 15.44,41.95 C2.1 16.73,41.67 C1.1 17.69,40.73 v17.91,40.51
  Bottom 0.203: v13.34,5.33 13.34,6.22 14.35,7.24 | v15.49,6.35 15.49,7.24 | v23.62,6.48 23.62,7.27 | v31.11,6.48 31.11,7.29 31.11,7.3 | 37.21,7.44 37.09,7.32 | v53.47,10.41 52.58,10.41 | v49.4,9.27 49.4,7.36 | v45.59,9.27 45.59,7.35 | v41.78,9.27 41.78,7.34 41.78,7.33
  Bottom 0.305: v37.21,8.26 37.21,7.44 | v49.4,38.73 49.4,39.88 | v45.59,38.86 45.59,39.88 | v41.91,38.61 41.91,39.88 | v38.23,38.61 38.23,39.88 | v53.09,32.77 52.32,32 | 51.56,32.77 49.4,32.77 v49.02,32.38 v44.7,32.38 v40.51,32.38 | 35.18,39.88 v35.18,34.54 33.02,32.38 v30.73,32.38 v26.67,32.38 v22.48,32.38 | v30.99,38.61 30.99,39.88 | v27.43,38.73 27.43,39.88 | v24,38.73 24,39.88 | v20.57,38.73 20.57,39.88
  Bottom 0.813: v17.91,40.51 18.54,39.88 20.57,39.88 24,39.88 27.43,39.88 30.99,39.88 35.18,39.88 38.23,39.88 41.91,39.88 45.59,39.88 49.4,39.88 50.29,39.88 51.56,38.61 51.56,32.77 52.32,32 56.77,27.56 56.77,16.76 52.58,12.57 52.58,10.41 52.58,9.02 50.93,7.37 49.4,7.36 45.59,7.35 41.78,7.33 37.09,7.32 31.11,7.3 23.62,7.27 15.49,7.24 14.35,7.24

### Text on the board
tPlace: PWM | RPUBUS.ORG
bPlace: 0V | 7V..36V | CS0 | CS1 | CS2 | CS3 | 0V | CS4 | CS5 | CS6 | CS7 | 0V | CS0..CS15 ARE EACH A / 22mA CURR SOURCE / CONTROLLED WITH THE / PCA9685 LED0..LED15 PINS | POWER | I2C | I2C | 0V | SCL | 3V3..5V | PWM | SDA | SDA | 3V3..5V | RPUBUS.ORG | SCL | 0V | 19099^0 | A0 | A1 | 0V | CS15 | CS14 | CS13 | CS12 | 0V | CS11 | CS10 | CS9 | CS8